# Altium schematic sheet LED_CONNECTOR.SchDoc
size A4; SheetNumber: 9; SheetTotal: 10
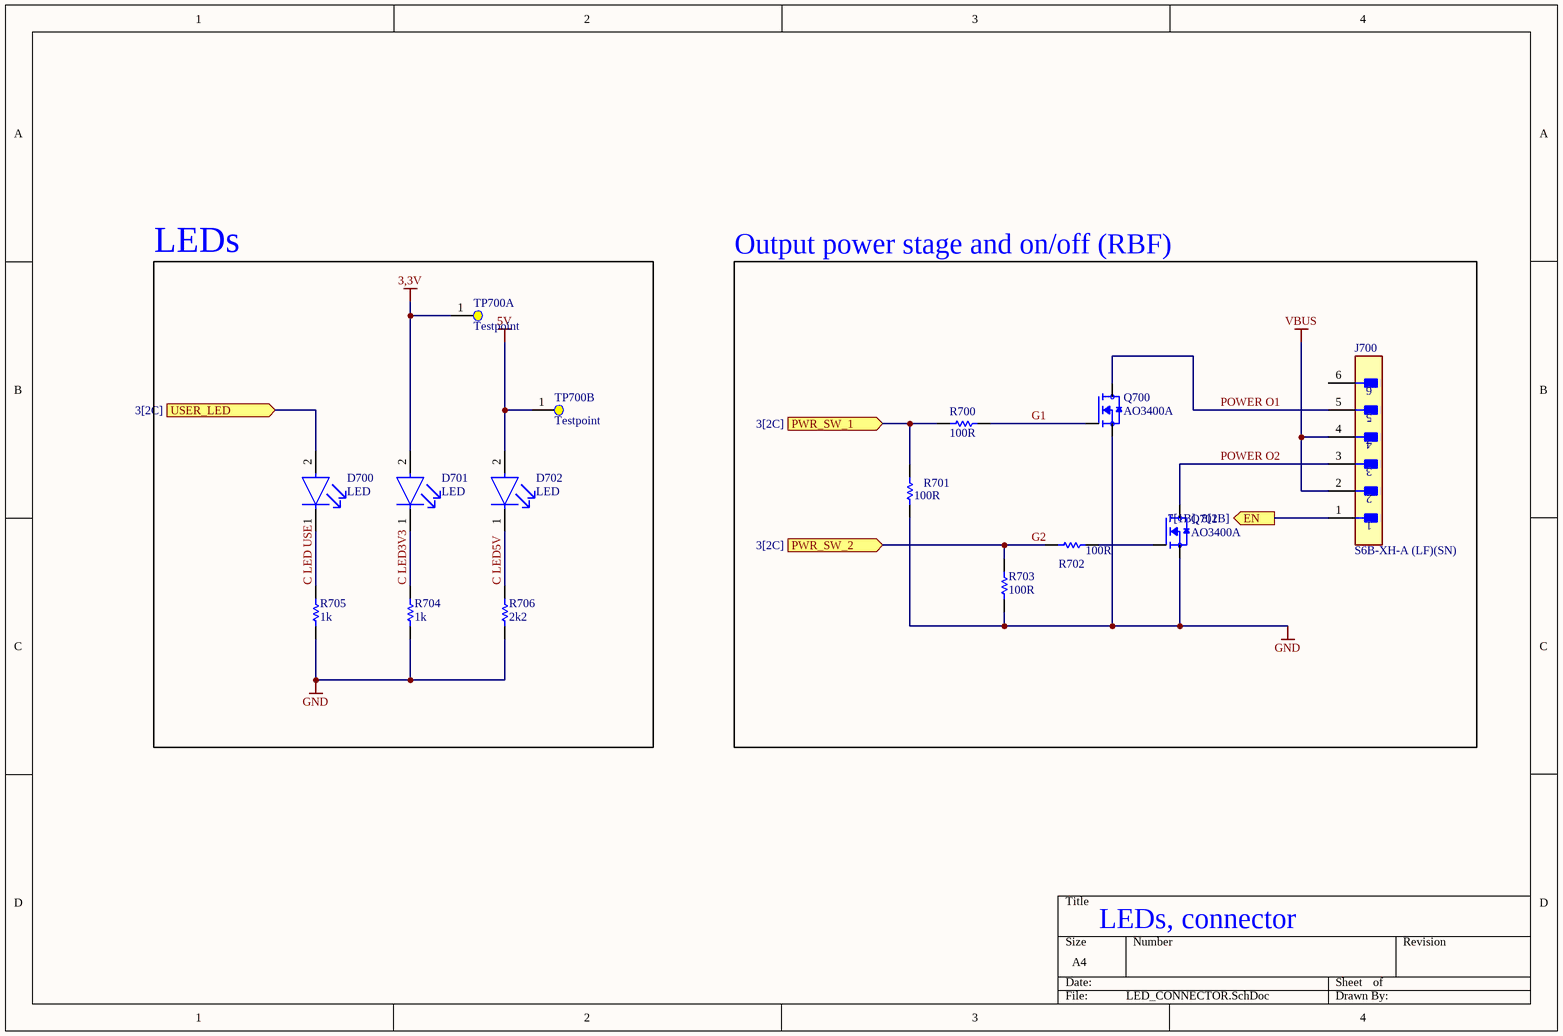
[diagram p0: LED_CONNECTOR.SchDoc]

## Parts
D700  LED  [FP-HSMG-C150-MFG]
D701  LED  [FP-HSMG-C150-MFG]
D702  LED  [FP-HSMG-C150-MFG]
J700  S6B-XH-A (LF)(SN)  [FP-S6B-XH-A_LF_SN-MFG]
Q700  AO3400A  [SOT95P280X125-3N]
Q701  AO3400A  [SOT95P280X125-3N]
R700  100R  [RESC1005X40X25ML05T10]
R701  100R  [RESC1609X50X30NL8T20]
R702  100R  [RESC1005X40X25ML05T10]
R703  100R  [RESC1609X50X30NL8T20]
R704  1k  [RESC2013X70X40LL20T20]
R705  1k  [RESC2013X70X40LL20T20]
R706  2k2  [RESC1609X50X30NL10T20]
TP700A  Testpoint  [Testpoint]
TP700B  Testpoint  [Testpoint]

## Blocks framed on the sheet
LEDs: D700-D702 R704-R706 TP700A TP700B
Output power stage and on/off (RBF): J700 Q700 Q701 R700-R703

## Ports
EN (out, see 7[1B], 8[2B]), PWR_SW_1 (in, see 3[2C]), PWR_SW_2 (in, see 3[2C]), USER_LED (in, see 3[2C])

## Nets
3,3V: D701.2(A) TP700A.1
5V: D702.2(A) TP700B.1
GND: Q700.2(S) Q701.2(S) R701.1 R703.1 R704.1 R705.1 R706.1
VBUS: J700.2 J700.4
C LED3V3: D701.1(C) R704.2
C LED5V: D702.1(C) R706.2
C LED USE: D700.1(C) R705.2
EN: J700.1 ; port EN
G1: Q700.1(G) R700.2
G2: R702.1 R703.2 ; port PWR_SW_2
POWER O1: J700.5 Q700.3(D)
POWER O2: J700.3 Q701.3(D)
PWR_SW_1: R700.1 R701.2 ; port PWR_SW_1
USER_LED: D700.2(A) ; port USER_LED
NetQ701_1: Q701.1(G) R702.2

Not connected (* = marked no-connect by the designer): J700 6

## Notes on the sheet
- LEDs, connector

## Library data of the parts
D700-D702 = CMP-2000-05061-2: LED GREEN DIFFUSED 1206 SMD; Manufacturer Part Number: HSMG-C150; Manufacturer: Broadcom; Led Orientation: Top View; Max Junction Temp: +95°C; Peak Emmision Wavelength: 570nm; Viewing Angle: 170°; Wavelength: 572nm; Reverse Voltage: 5V; Luminous Intensity: 15mcd; Forward Voltage: 2.2V; Power Dissipation: 65mW; Forward Current: 20mA; ComponentLink2Description: Datasheet; Lead Free: Yes; Temperature Range Low: -40°C; Package: HSMG-C150; Digikey Description: LED GREEN DIFFUSED 1206 SMD; Mouser Description: LED Uni-Color Green 570nm 2-Pin Chip LED T/R; Temperature Range High: +85°C; Device Class L1: Optoelectronics; Colour: Green; Category: Diode; Device Class L3: unset; RoHS: TRUE; Height: 1.2mm; ComponentLink2URL: https://docs.broadcom.com/docs/AV02-0551EN; Device Class L2: LEDs; Automotive: No; Ipc Land Pattern Name: DIOCP320160X55; Octopart: https://octopart.com/hsmg-c150-broadcom-71131304; Temperature: -40°C to +85°C
J700 = CMP-17439-000165-2: CONN HEADER R/A 6POS 2.5MM; Number of Contacts: 6; Contact Resistance: 20mR; Max Current Rating: 3A; Max Voltage Rating (AC): 250V; Gender: Male; Insulation Resistance: 1GR; Wire/Cable Gauge: 22AWG; Fastening Type: Detent; Lead Pitch: 2.5mm; Flammability Rating: UL94 V-0; Contact Finish - Mating: TIN; Housing Material: Polyamide; Length: 17.4mm; Termination: Solder; Contact Type: Male Pin; Number of Positions: 6; Mount: Through Hole; Orientation: Right Angle; Voltage Rating (AC): 250V; Contact Shape: Square; Lead Free: Lead Free; Insulation Material: Nylon; Insulation Color: Natural; Contact Plating: Tin; Connector Type: Header; Housing Color: White; Color: Natural; Package Quantity: 500; Contact Material: Brass; Packaging: Bulk; Pitch: 2.5mm; Series: XH; Number of Rows: 1; Min Operating Temperature: -25°C; Voltage Rating: 250V; REACH SVHC: No SVHC; Current Rating: 3A; Depth: 11.5mm; Max Operating Temperature: 85°C
Q700 Q701 = AO3400A: Trans MOSFET N-CH 30V 5.7A 3-Pin SOT-23; Package: None; Price: None; Availability: Unavailable; MP: AO3400A; Value: *
R700 R702 = CMP-2002-07344-1: Part Number: RC0402FR-07100RL; Manufacturer: Yageo / Phycomp
R701 R703 = CMP-1666-00005-4: Chip Resistor, 10 KOhm, +/- 1%, 100 mW, -55 to 155 degC, 0603 (1608 Metric), RoHS, Tape and Reel; Manufacturer: Vishay Semiconductor; Voltage Rating: 75 V; Max Operating Temperature: 155 degC; PackageDescription: 2-Pin Surface Mount Device, Body 1.575 x 0.85 mm; ComponentLink1Description: Manufacturer URL; RoHSCompliant: true; PackageReference: 0603; REACH SVHC: Unknown; Length: 1.55 mm; DatasheetVersion: 06/2012; Packaging: Tape and Reel; Min Operating Temperature: -55 degC; Mounting Technology: Surface Mount; ComponentLink2URL: https://datasheet.ciiva.com/11809/0900766b80d98afc-11809037.pdf; Height: 0.45 mm; ComponentLink2Description: Datasheet; Package Quantity: 5000; ComponentLink1URL: http://www.vishay.com/
R704 R705 = CMP-2001-04375-5: Chip Resistor, 1 KOhm, +/- 1%, 0.125 W, -55 to 155 degC, 0805 (2012 Metric), RoHS, Tape and Reel; Manufacturer: Panasonic; Voltage Rating: 150 V; ComponentLink1URL: http://www.panasonic.com/; ComponentLink2Description: Datasheet; REACH SVHC: Yes; ComponentLink1Description: Manufacturer URL; Length: 2 mm; Height: 0.6 mm; Package Quantity: 1; PackageDescription: 2-Pin Surface Mount Device, Body 2 x 1.25 mm; Packaging: Cut Tape; PackageReference: 0805; Max Operating Temperature: 155 degC; Mounting Technology: Surface Mount; ComponentLink2URL: http://industrial.panasonic.com/cdbs/www-data/pdf/RDA0000/AOA0000C86.pdf; DatasheetVersion: 04/2015; Min Operating Temperature: -55 degC; RoHSCompliant: true; Mount: Surface Mount
R706 = CMP-2000-03167-1: Part Number: CRCW06032K20FKEA; Manufacturer: Vishay Dale